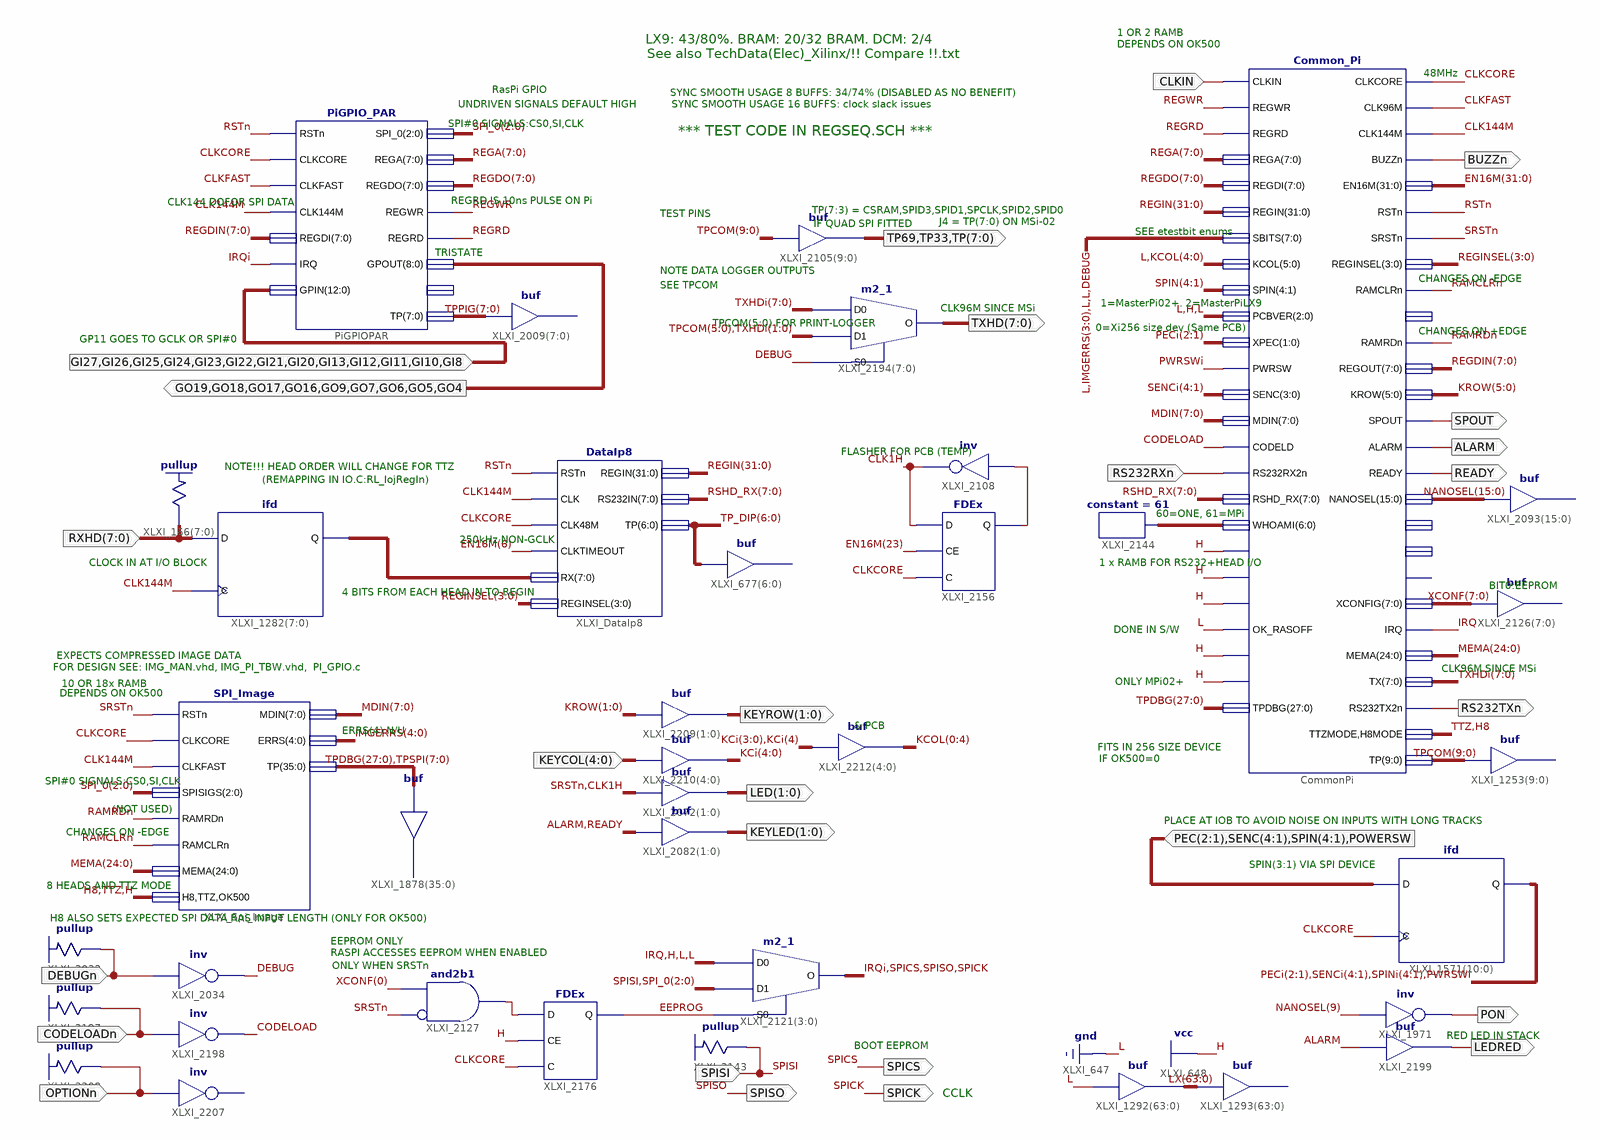
[diagram p0: schematic sheet 1]
// Xilinx ISE schematic MasterX.sch (spartan6) as structural Verilog: 37 symbols, 26 ports
module MasterX (
  input  [7:0] RXHD,
  input  SPISI,
  input  RS232RXn,
  input  [2:1] PEC,
  input  [4:1] SENC,
  input  [4:1] SPIN,
  input  POWERSW,
  input  GI27,
  input  GI26,
  input  GI25,
  input  GI24,
  input  GI23,
  input  GI22,
  input  GI21,
  input  GI20,
  input  GI13,
  input  GI12,
  input  GI11,
  input  GI10,
  input  GI8,
  input  CLKIN,
  input  OPTIONn,
  input  DEBUGn,
  input  CODELOADn,
  input  [4:0] KEYCOL,
  output LEDRED,
  output PON,
  output SPICK,
  output SPICS,
  output SPISO,
  output ALARM,
  output READY,
  output SPOUT,
  output BUZZn,
  output RS232TXn,
  output GO19,
  output GO18,
  output GO17,
  output GO16,
  output GO9,
  output GO7,
  output GO6,
  output GO5,
  output GO4,
  output TP69,
  output TP33,
  output [7:0] TP,
  output [1:0] LED,
  output [1:0] KEYLED,
  output [1:0] KEYROW,
  output [7:0] TXHD
);

  wire CLK1H, CLK144M, CLKCORE, CLKFAST, CODELOAD, DEBUG, EEPROG, H8, IRQ, IRQi, PWRSWi, RAMCLRn, RAMRDn,
       REGRD, REGWR, RSTn, SRSTn, TTZ, XLXN_184, XLXN_379;
  wire [2:0] SPI_0;
  wire [2:1] PECi;
  wire [3:0] REGINSEL;
  wire [4:0] IMGERRS, KCi, KCOL;
  wire [4:1] SENCi, SPINi;
  wire [5:0] KROW;
  wire [6:0] TP_DIP, XLXN_196;
  wire [7:0] MDIN, REGA, REGDIN, REGDO, RSHD_RX, TPPIG, TPSPI, TXHDi, XCONF, XLXN_33;
  wire [9:0] TPCOM;
  wire [15:0] NANOSEL;
  wire [24:0] MEMA;
  wire [27:0] TPDBG;
  wire [31:0] EN16M, REGIN;
  wire [63:0] LX;

  \pullup  XLXI_166[7:0] (.O(RXHD));
  ifd XLXI_1282[7:0] (.C(CLK144M), .D(RXHD), .Q(XLXN_33));
  assign LX = {64{1'b0}};  // buf XLXI_1292[63..0], 64 bits wide
  // buf XLXI_1293[63..0] has open pins: I=LX, O=open
  not XLXI_1971 (PON, NANOSEL[9]);
  not XLXI_2108 (CLK1H, XLXN_184);
  FDEx XLXI_2156 (.C(CLKCORE), .CE(EN16M[23]), .D(CLK1H), .Q(XLXN_184));
  constant #(.CValue("61")) XLXI_2144 (.O(XLXN_196));
  m2_1 XLXI_2121[3:0] (.D0({IRQ, 3'b100}), .D1({SPISI, SPI_0}), .S0(EEPROG), .O({IRQi, SPICS, SPISO, SPICK}));
  \pullup  XLXI_2143 (.O(SPISI));
  ifd XLXI_1571[10:0] (.C(CLKCORE), .D({PEC, SENC, SPIN, POWERSW}), .Q({PECi, SENCi, SPINi, PWRSWi}));
  // buf XLXI_2093[15..0] has open pins: I=NANOSEL, O=open
  // buf XLXI_2126[7..0] has open pins: I=XCONF, O=open
  FDEx XLXI_2176 (.C(CLKCORE), .CE(1'b1), .D(XLXN_379), .Q(EEPROG));
  and XLXI_2127 (XLXN_379, ~SRSTn, XCONF[0]);  // and2b1
  // buf XLXI_677[6..0] has open pins: I=TP_DIP, O=open
  DataIp8 XLXI_DataIp8 (
    .CLK(CLK144M), .CLK48M(CLKCORE), .CLKTIMEOUT(EN16M[6]), .REGIN(REGIN), .REGINSEL(REGINSEL),
    .RS232IN(RSHD_RX), .RSTn(RSTn), .RX(XLXN_33), .TP(TP_DIP));
  // buf XLXI_2009[7..0] has open pins: I=TPPIG, O=open
  // buf XLXI_1253[9..0] has open pins: I=TPCOM, O=open
  buf XLXI_2199 (LEDRED, ALARM);
  Common_Pi CommonPi (
    .ALARM(ALARM), .BUZZn(BUZZn), .CLK144M(CLK144M), .CLK96M(CLKFAST), .CLKCORE(CLKCORE), .CLKIN(CLKIN),
    .CODELD(CODELOAD), .EN16M(EN16M), .IRQ(IRQ), .ISCLK48M(1'b1), .KCOL({1'b0, KCOL}), .KROW(KROW),
    .MASTERPi_Si(1'b1), .MDIN(MDIN), .MEMA(MEMA), .NANOSEL(NANOSEL), .OK_500(1'b1), .OK_RASOFF(1'b0),
    .OK_RS232(1'b1), .OK_RSHEAD(1'b1), .PCBVER(3'b010), .PWRSW(PWRSWi), .RAMCLRn(RAMCLRn), .RAMRDn(RAMRDn),
    .READY(READY), .REGA(REGA), .REGDI(REGDO), .REGIN(REGIN), .REGINSEL(REGINSEL), .REGOUT(REGDIN),
    .REGRD(REGRD), .REGWR(REGWR), .RS232RX2n(RS232RXn), .RS232TX2n(RS232TXn), .RSHD_RX(RSHD_RX), .RSTn(RSTn),
    .SENC(SENCi), .SPIN(SPIN), .SPOUT(SPOUT), .SRSTn(SRSTn), .TP(TPCOM),
    .SBITS({1'b0, IMGERRS[3:0], 2'b00, DEBUG}), .TTZMODE(TTZ), .H8MODE(H8), .TX(TXHDi), .WHOAMI(XLXN_196),
    .XCONFIG(XCONF), .XPEC(PECi), .TPDBG(TPDBG));  // open: FIRE_EN, HDATA0, HDATA0_EN, HREG0
  assign {TP69, TP33, TP} = TPCOM;  // buf XLXI_2105[9..0], 10 bits wide
  SPI_Image XLXI_Spi_Image (
    .CLKCORE(CLKCORE), .CLKFAST(CLK144M), .ERRS(IMGERRS), .H8(H8), .TTZ(TTZ), .OK500(1'b1), .MDIN(MDIN),
    .MEMA(MEMA), .RAMCLRn(RAMCLRn), .RAMRDn(RAMRDn), .RSTn(SRSTn), .SPISIGS(SPI_0), .TP({TPDBG, TPSPI}));
  // buf XLXI_1878[35..0] has open pins: I={TPDBG, TPSPI}, O=open
  PiGPIO_PAR PiGPIOPAR (
    .CLK144M(CLK144M), .CLKCORE(CLKCORE), .CLKFAST(CLKFAST),
    .GPIN({GI27, GI26, GI25, GI24, GI23, GI22, GI21, GI20, GI13, GI12, GI11, GI10, GI8}),
    .GPOUT({GO19, GO18, GO17, GO16, GO9, GO7, GO6, GO5, GO4}), .IRQ(IRQi), .REGA(REGA), .REGDI(REGDIN),
    .REGDO(REGDO), .REGRD(REGRD), .REGWR(REGWR), .RSTn(RSTn), .SPI_0(SPI_0), .TP(TPPIG));  // open: LASTWR
  // inv XLXI_2207 has open pins: I=OPTIONn, O=open
  \pullup  XLXI_2208 (.O(OPTIONn));
  \pullup  XLXI_2033 (.O(DEBUGn));
  not XLXI_2198 (CODELOAD, CODELOADn);
  \pullup  XLXI_2197 (.O(CODELOADn));
  not XLXI_2034 (DEBUG, DEBUGn);
  assign LED = {SRSTn, CLK1H};  // buf XLXI_2072[1..0], 2 bits wide
  assign KEYLED = {ALARM, READY};  // buf XLXI_2082[1..0], 2 bits wide
  m2_1 XLXI_2194[7:0] (.D0(TXHDi), .D1({TPCOM[5:0], TXHDi[1:0]}), .S0(DEBUG), .O(TXHD));
  assign KEYROW = KROW[1:0];  // buf XLXI_2209[1..0], 2 bits wide
  assign KCi = KEYCOL;  // buf XLXI_2210[4..0], 5 bits wide
  assign {KCOL[0], KCOL[1], KCOL[2], KCOL[3], KCOL[4]} = {KCi[3:0], KCi[4]};  // buf XLXI_2212[4..0], 5 bits wide

  // Notes on the sheet:
  //   1 OR 2 RAMB
  //   LX9: 43/80%. BRAM: 20/32 BRAM. DCM: 2/4
  //   DEPENDS ON OK500
  //   See also TechData(Elec)_Xilinx/!! Compare !!.txt
  //   48MHz
  //   RasPi GPIO
  //   SYNC SMOOTH USAGE 8 BUFFS: 34/74% (DISABLED AS NO BENEFIT)
  //   UNDRIVEN SIGNALS DEFAULT HIGH
  //   SYNC SMOOTH USAGE 16 BUFFS: clock slack issues
  //   SPI#0 SIGNALS:CS0,SI,CLK
  //   *** TEST CODE IN REGSEQ.SCH ***
  //   REGRD IS 10ns PULSE ON Pi
  //   CLK144 DOFOR SPI DATA
  //   TP(7:3) = CSRAM,SPID3,SPID1,SPCLK,SPID2,SPID0
  //   TEST PINS
  //   J4 = TP(7:0) ON MSi-02
  //   IF QUAD SPI FITTED
  //   SEE etestbit enums
  //   TRISTATE
  //   NOTE DATA LOGGER OUTPUTS
  //   CHANGES ON -EDGE
  //   SEE TPCOM
  //   1=MasterPi02+. 2=MasterPiLX9
  //   CLK96M SINCE MSi
  //   TPCOM(5:0) FOR PRINT-LOGGER
  //   0=Xi256 size dev (Same PCB)
  //   CHANGES ON +EDGE
  //   GP11 GOES TO GCLK OR SPI#0
  //   FLASHER FOR PCB (TEMP)
  //   NOTE!!! HEAD ORDER WILL CHANGE FOR TTZ
  //   (REMAPPING IN IO.C:RL_IojRegIn)
  //   60=ONE, 61=MPi
  //   250kHz NON-GCLK
  //   CLOCK IN AT I/O BLOCK
  //   1 x RAMB FOR RS232+HEAD I/O
  //   BIT0:EEPROM
  //   4 BITS FROM EACH HEAD IN TO REGIN
  //   DONE IN S/W
  //   EXPECTS COMPRESSED IMAGE DATA
  //   FOR DESIGN SEE: IMG_MAN.vhd, IMG_PI_TBW.vhd,  PI_GPIO.c
  //   CLK96M SINCE MSi
  //   ONLY MPi02+
  //   10 OR 18x RAMB
  //   DEPENDS ON OK500
  //   & PCB
  //   ERRS(4) N/U
  //   FITS IN 256 SIZE DEVICE
  //   IF OK500=0
  //   SPI#0 SIGNALS:CS0,SI,CLK
  //   (NOT USED)
  //   PLACE AT IOB TO AVOID NOISE ON INPUTS WITH LONG TRACKS
  //   CHANGES ON -EDGE
  //   SPIN(3:1) VIA SPI DEVICE
  //   8 HEADS AND TTZ MODE
  //   H8 ALSO SETS EXPECTED SPI DATA RAS INPUT LENGTH (ONLY FOR OK500)
  //   EEPROM ONLY
  //   RASPI ACCESSES EEPROM WHEN ENABLED
  //   ONLY WHEN SRSTn
  //   RED LED IN STACK
  //   BOOT EEPROM
  //   CCLK
endmodule
